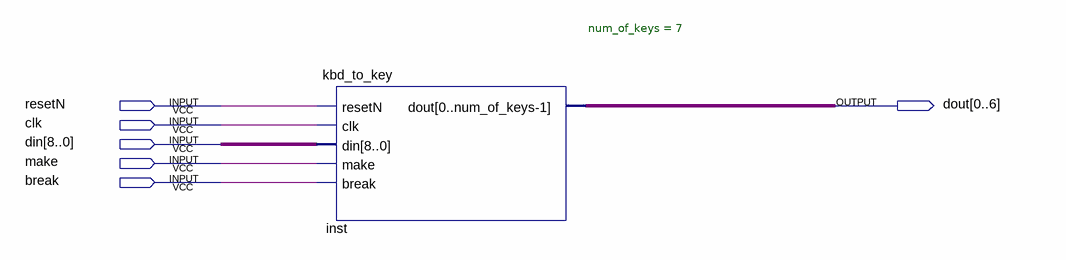
[diagram p0: schematic sheet]
// Quartus schematic kbd_logic.bdf as structural Verilog: 1 symbols, 6 pins
module kbd_logic (
  input  resetN,
  input  clk,
  input  [8:0] din,
  input  make,
  input  \break ,
  output [0:6] dout
);

  kbd_to_key #(.num_of_keys(7)) inst (
    .resetN(resetN), .clk(clk), .din(din), .make(make), .\break (\break ), .dout(dout));
endmodule
